# EAGLE schematic MainBoard (EAGLE 9.1.2)

## Sheet 1 of 2: LOGIC
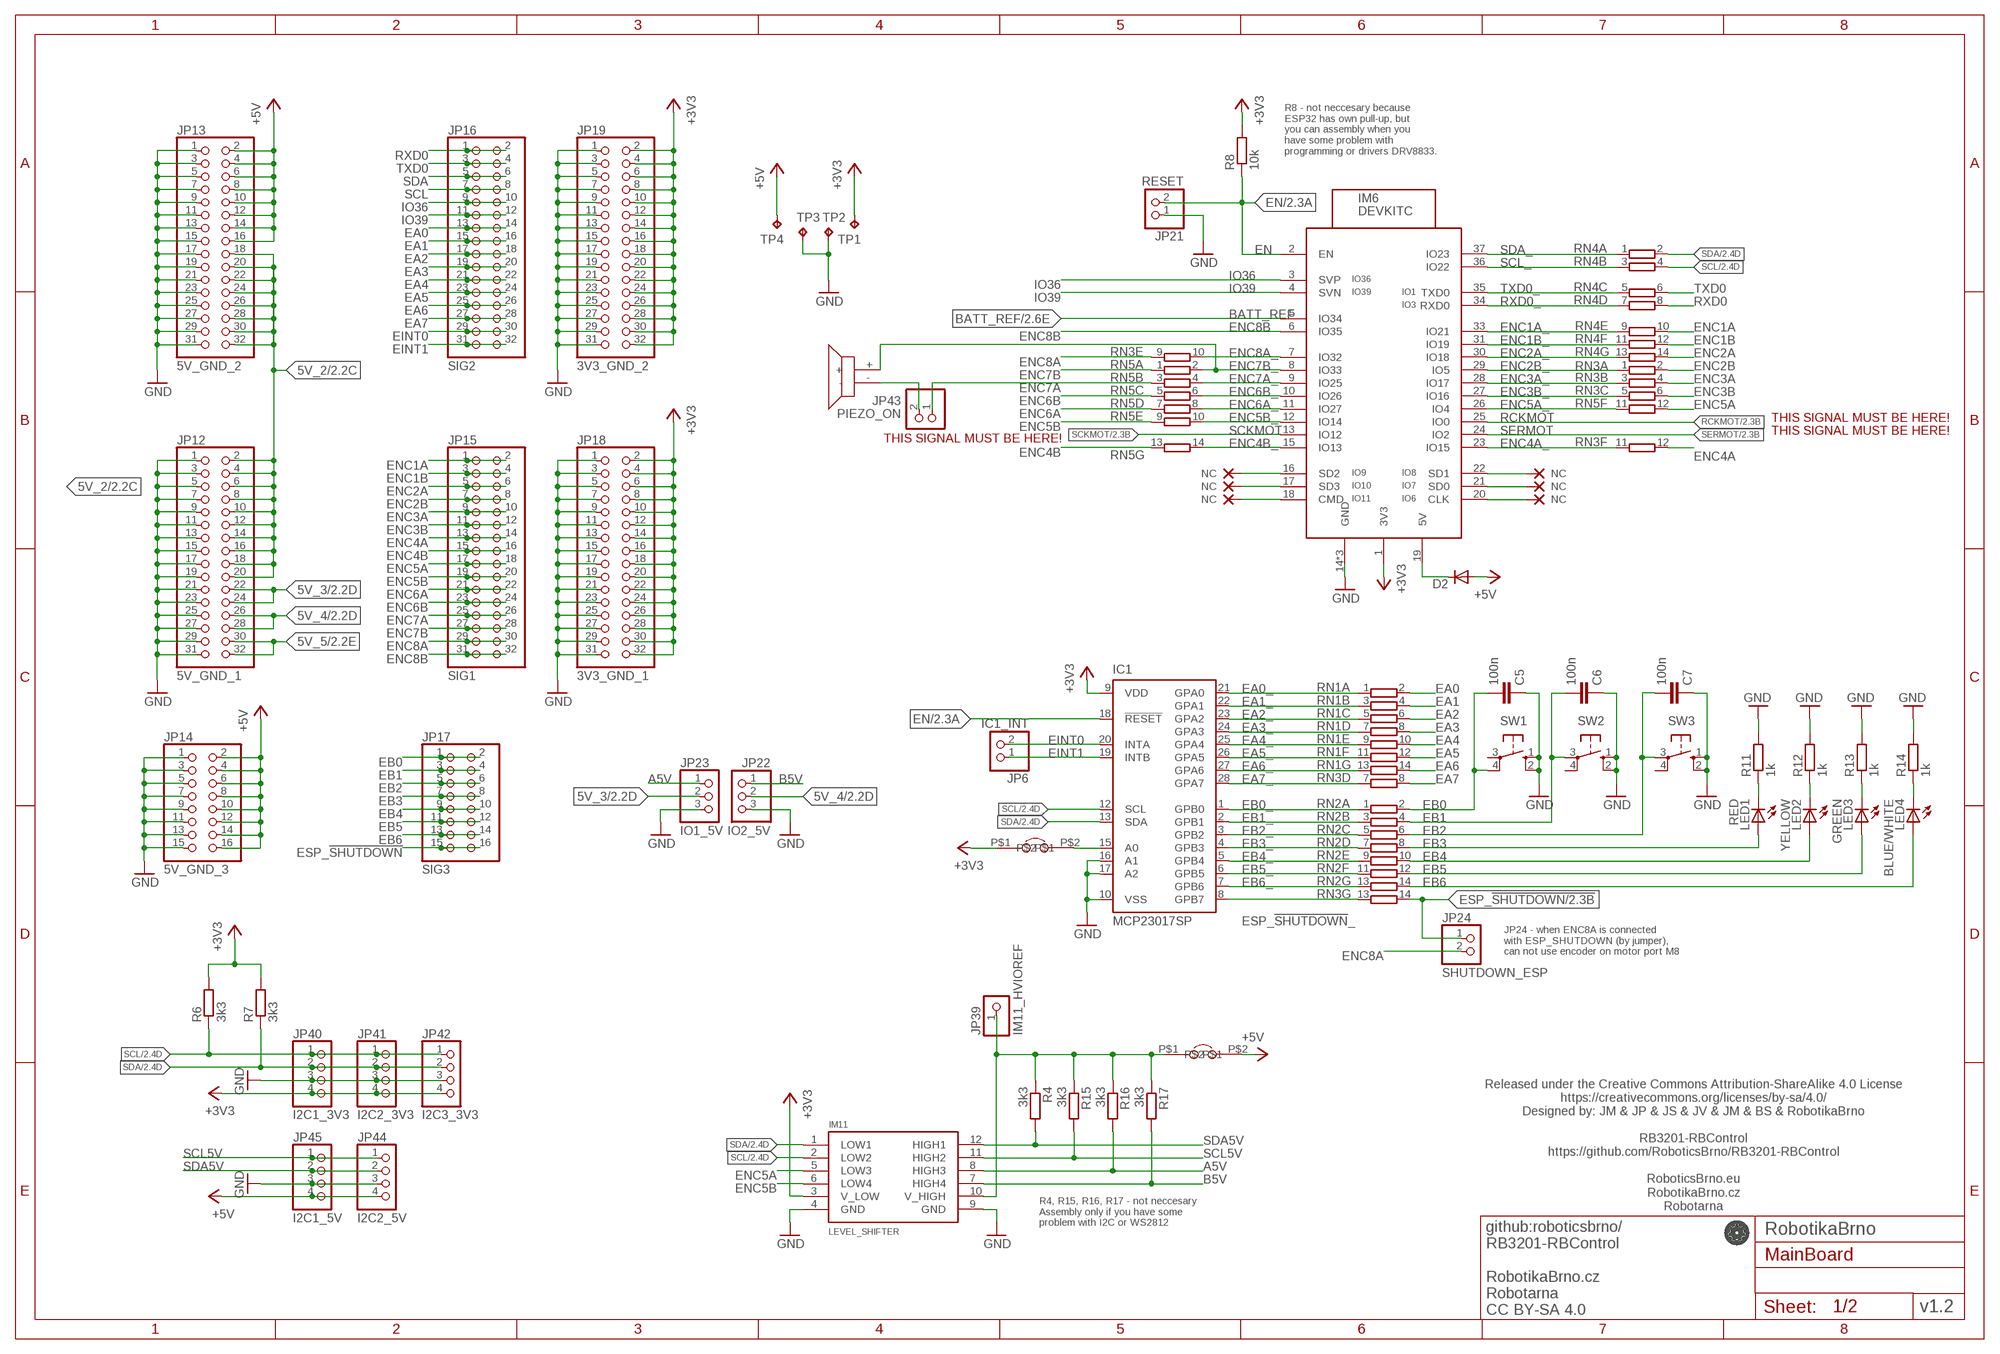
[diagram p0: schematic, sheet 1]

### Parts
C5  100n  C-EUC1206  [C1206]
C6  100n  C-EUC1206  [C1206]
C7  100n  C-EUC1206  [C1206]
D2  DIODE-D-7.5  [D-7.5]
IC1  MCP23017SP  [DIL28-3]
IM6  DEVKITC  [DEVKITC]
IM11  LEVEL_SHIFTER  [LEVEL_SHIFTER]
JP6  IC1_INT  PINHD-1X2  [1X02]
JP12  5V_GND_1  PINHD-2X16  [2X16]
JP13  5V_GND_2  PINHD-2X16  [2X16]
JP14  5V_GND_3  PINHD-2X8  [2X08]
JP15  SIG1  PINHD-2X16  [2X16]
JP16  SIG2  PINHD-2X16  [2X16]
JP17  SIG3  PINHD-2X8  [2X08]
JP18  3V3_GND_1  PINHD-2X16  [2X16]
JP19  3V3_GND_2  PINHD-2X16  [2X16]
JP21  RESET  PINHD-1X2  [1X02]
JP22  IO2_5V  PINHD-1X3  [1X03]
JP23  IO1_5V  PINHD-1X3  [1X03]
JP24  SHUTDOWN_ESP  PINHD-1X2  [1X02]
JP39  IM11_HVIOREF  PINHD-1X1  [1X01]
JP40  I2C1_3V3  PINHD-1X4  [1X04]
JP41  I2C2_3V3  PINHD-1X4  [1X04]
JP42  I2C3_3V3  PINHD-1X4  [1X04]
JP43  PIEZO_ON  PINHD-1X2/90  [1X02/90]
JP44  I2C2_5V  PINHD-1X4  [1X04]
JP45  I2C1_5V  PINHD-1X4  [1X04]
LED1  RED  LED3MM  [LED3MM]
LED2  YELLOW  LED3MM  [LED3MM]
LED3  GREEN  LED3MM  [LED3MM]
LED4  BLUE/WHITE  LED3MM  [LED3MM]
NC1  NC  (no package)
NC2  NC  (no package)
NC3  NC  (no package)
NC4  NC  (no package)
NC5  NC  (no package)
NC6  NC  (no package)
PIEZO  PIEZO  [PIEZO]
R4  3k3  R-EU_0204/2V  [0204V]
R6  3k3  R-EU_0204/2V  [0204V]
R7  3k3  R-EU_0204/2V  [0204V]
R8  10k  R-EU_0204/2V  [0204V]
R11  1k  R-EU_0204/2V  [0204V]
R12  1k  R-EU_0204/2V  [0204V]
R13  1k  R-EU_0204/2V  [0204V]
R14  1k  R-EU_0204/2V  [0204V]
R15  3k3  R-EU_0204/2V  [0204V]
R16  3k3  R-EU_0204/2V  [0204V]
R17  3k3  R-EU_0204/2V  [0204V]
RN1  E7R  [SIL14]
RN2  E7R  [SIL14]
RN3  E7R  [SIL14]
RN4  E7R  [SIL14]
RN5  E7R  [SIL14]
SW1  10-XX  [B3F-10XX]
SW2  10-XX  [B3F-10XX]
SW3  10-XX  [B3F-10XX]
TP1  TPTP20SQ  [TP20SQ]
TP2  TPTP20SQ  [TP20SQ]
TP3  TPTP20SQ  [TP20SQ]
TP4  TPTP20SQ  [TP20SQ]
U$1  SJ_NC  [SJ_NC]
U$2  SJ_NC  [SJ_NC]

### Nets
5V_2: JP12.2 JP12.4 JP12.6 JP12.8 JP12.10 JP12.12 JP12.14 JP12.16 JP12.18 JP12.20 JP13.18 JP13.20 JP13.22 JP13.24 JP13.26 JP13.28 JP13.30 JP13.32 ; also sheet 2
5V_3: JP12.22 JP12.24 JP23.2 ; also sheet 2
5V_4: JP12.26 JP12.28 JP22.2 ; also sheet 2
5V_5: JP12.30 JP12.32 ; also sheet 2
+3V3: IC1.9(VDD) IM6.1(3V3) IM11.3(V_LOW) JP18.2 JP18.4 JP18.6 JP18.8 JP18.10 JP18.12 JP18.14 JP18.16 JP18.18 JP18.20 JP18.22 JP18.24 JP18.26 JP18.28 JP18.30 JP18.32 JP19.2 JP19.4 JP19.6 JP19.8 JP19.10 JP19.12 JP19.14 JP19.16 JP19.18 JP19.20 JP19.22 JP19.24 JP19.26 JP19.28 JP19.30 JP19.32 JP40.4 JP41.4 JP42.4 R6.2 R7.2 R8.2 TP1.TP U$1.P$1 ; also sheet 2
+5V: D2.A JP13.2 JP13.4 JP13.6 JP13.8 JP13.10 JP13.12 JP13.14 JP13.16 JP14.2 JP14.4 JP14.6 JP14.8 JP14.10 JP14.12 JP14.14 JP14.16 JP44.4 JP45.4 TP4.TP U$2.P$2 ; also sheet 2
+5V_ESP: D2.C IM6.19(5V)
A5V: IM11.8(HIGH3) JP23.1 R16.2
B5V: IM11.7(HIGH4) JP22.1 R17.2
BATT_REF: IM6.5(IO34) ; also sheet 2
EA0: JP16.13 JP16.14 RN1.2
EA0_: IC1.21(GPA0) RN1.1
EA1: JP16.15 JP16.16 RN1.4
EA1_: IC1.22(GPA1) RN1.3
EA2: JP16.17 JP16.18 RN1.6
EA2_: IC1.23(GPA2) RN1.5
EA3: JP16.19 JP16.20 RN1.8
EA3_: IC1.24(GPA3) RN1.7
EA4: JP16.21 JP16.22 RN1.10
EA4_: IC1.25(GPA4) RN1.9
EA5: JP16.23 JP16.24 RN1.12
EA5_: IC1.26(GPA5) RN1.11
EA6: JP16.25 JP16.26 RN1.14
EA6_: IC1.27(GPA6) RN1.13
EA7: JP16.27 JP16.28 RN3.8
EA7_: IC1.28(GPA7) RN3.7
EB0: C5.2 JP17.1 JP17.2 RN2.2 SW1.4(P1)
EB0_: IC1.1(GPB0) RN2.1
EB1: C6.2 JP17.3 JP17.4 RN2.4 SW2.3(P)
EB1_: IC1.2(GPB1) RN2.3
EB2: C7.2 JP17.5 JP17.6 RN2.6 SW3.3(P)
EB2_: IC1.3(GPB2) RN2.5
EB3: JP17.7 JP17.8 LED1.A RN2.8
EB3_: IC1.4(GPB3) RN2.7
EB4: JP17.9 JP17.10 LED2.A RN2.10
EB4_: IC1.5(GPB4) RN2.9
EB5: JP17.11 JP17.12 LED3.A RN2.12
EB5_: IC1.6(GPB5) RN2.11
EB6: JP17.13 JP17.14 LED4.A RN2.14
EB6_: IC1.7(GPB6) RN2.13
EINT0: IC1.20(INTA) JP6.2 JP16.29 JP16.30
EINT1: IC1.19(INTB) JP6.1 JP16.31 JP16.32
EN: IC1.18(!RESET) IM6.2(EN) JP21.2 R8.1 ; also sheet 2
ENC1A: JP15.1 JP15.2 RN4.10 ; also sheet 2
ENC1A_: IM6.33(IO21) RN4.9
ENC1B: JP15.3 JP15.4 RN4.12 ; also sheet 2
ENC1B_: IM6.31(IO19) RN4.11
ENC2A: JP15.5 JP15.6 RN4.14 ; also sheet 2
ENC2A_: IM6.30(IO18) RN4.13
ENC2B: JP15.7 JP15.8 RN3.2 ; also sheet 2
ENC2B_: IM6.29(IO5) RN3.1
ENC3A: JP15.9 JP15.10 RN3.4 ; also sheet 2
ENC3A_: IM6.28(IO17) RN3.3
ENC3B: JP15.11 JP15.12 RN3.6 ; also sheet 2
ENC3B_: IM6.27(IO16) RN3.5
ENC4A: JP15.13 JP15.14 RN3.12 ; also sheet 2
ENC4A_: IM6.23(IO15) RN3.11
ENC4B: JP15.15 JP15.16 RN5.13 ; also sheet 2
ENC4B_: IM6.15(IO13) RN5.14
ENC5A: IM11.5(LOW3) JP15.17 JP15.18 RN5.12 ; also sheet 2
ENC5A_: IM6.26(IO4) RN5.11
ENC5B: IM11.6(LOW4) JP15.19 JP15.20 RN5.9 ; also sheet 2
ENC5B_: IM6.12(IO14) RN5.10
ENC6A: JP15.21 JP15.22 RN5.7 ; also sheet 2
ENC6A_: IM6.11(IO27) RN5.8
ENC6B: JP15.23 JP15.24 RN5.5 ; also sheet 2
ENC6B_: IM6.10(IO26) RN5.6
ENC7A: JP15.25 JP15.26 JP43.1 RN5.3 ; also sheet 2
ENC7A_: IM6.9(IO25) RN5.4
ENC7B: JP15.27 JP15.28 RN5.1 ; also sheet 2
ENC7B_: IM6.8(IO33) PIEZO.+ RN5.2
ENC8A: JP15.29 JP15.30 JP24.2 RN3.9 ; also sheet 2
ENC8A_: IM6.7(IO32) RN3.10
ENC8B: IM6.6(IO35) JP15.31 JP15.32 ; also sheet 2
ESP_!SHUTDOWN: JP17.15 JP17.16 JP24.1 RN3.14 ; also sheet 2
ESP_!SHUTDOWN!_: IC1.8(GPB7) RN3.13
EXP_A0: IC1.15(A0) U$1.P$2
GND: C5.1 C6.1 C7.1 IC1.10(VSS) IC1.16(A1) IC1.17(A2) IM6.14(GND) IM6.32(GND) IM6.38(GND) IM11.4(GND) IM11.9(GND) JP12.1 JP12.3 JP12.5 JP12.7 JP12.9 JP12.11 JP12.13 JP12.15 JP12.17 JP12.19 JP12.21 JP12.23 JP12.25 JP12.27 JP12.29 JP12.31 JP13.1 JP13.3 JP13.5 JP13.7 JP13.9 JP13.11 JP13.13 JP13.15 JP13.17 JP13.19 JP13.21 JP13.23 JP13.25 JP13.27 JP13.29 JP13.31 JP14.1 JP14.3 JP14.5 JP14.7 JP14.9 JP14.11 JP14.13 JP14.15 JP18.1 JP18.3 JP18.5 JP18.7 JP18.9 JP18.11 JP18.13 JP18.15 JP18.17 JP18.19 JP18.21 JP18.23 JP18.25 JP18.27 JP18.29 JP18.31 JP19.1 JP19.3 JP19.5 JP19.7 JP19.9 JP19.11 JP19.13 JP19.15 JP19.17 JP19.19 JP19.21 JP19.23 JP19.25 JP19.27 JP19.29 JP19.31 JP21.1 JP22.3 JP23.3 JP40.3 JP41.3 JP42.3 JP44.3 JP45.3 R11.2 R12.2 R13.2 R14.2 SW1.1(S) SW1.2(S1) SW2.1(S) SW2.2(S1) SW3.1(S) SW3.2(S1) TP2.TP TP3.TP ; also sheet 2
HVIOREF: IM11.10(V_HIGH) JP39.1 R4.1 R15.1 R16.1 R17.1 U$2.P$1
IO6_NC: IM6.20(CLK) NC6.NC
IO7_NC: IM6.21(SD0) NC5.NC
IO8_NC: IM6.22(SD1) NC4.NC
IO9_NC: IM6.16(SD2) NC1.NC
IO10_NC: IM6.17(SD3) NC2.NC
IO11_NC: IM6.18(CMD) NC3.NC
IO36: IM6.3(SVP) JP16.9 JP16.10
IO39: IM6.4(SVN) JP16.11 JP16.12
LED1: LED1.K(C) R11.1
LED2: LED2.K(C) R12.1
LED3: LED3.K(C) R13.1
LED4: LED4.K(C) R14.1
PIEZO: JP43.2 PIEZO.-
RCKMOT: IM6.25(IO0) ; also sheet 2
RXD0: JP16.1 JP16.2 RN4.8
RXD0_: IM6.34(RXD0) RN4.7
SCKMOT: IM6.13(IO12) ; also sheet 2
SCL: IC1.12(SCL) IM11.2(LOW2) JP16.7 JP16.8 JP40.1 JP41.1 JP42.1 R6.1 RN4.4 ; also sheet 2
SCL5V: IM11.11(HIGH2) JP44.1 JP45.1 R15.2
SCL_: IM6.36(IO22) RN4.3
SDA: IC1.13(SDA) IM11.1(LOW1) JP16.5 JP16.6 JP40.2 JP41.2 JP42.2 R7.1 RN4.2 ; also sheet 2
SDA5V: IM11.12(HIGH1) JP44.2 JP45.2 R4.2
SDA_: IM6.37(IO23) RN4.1
SERMOT: IM6.24(IO2) ; also sheet 2
TXD0: JP16.3 JP16.4 RN4.6
TXD0_: IM6.35(TXD0) RN4.5
Unconnected: SW1.3(P) SW2.4(P1) SW3.4(P1)

### Notes on the sheet
- R8 - not neccesary because 
  ESP32 has own pull-up, but
  you can assembly when you
  have some problem with 
  programming or drivers DRV8833.
- THIS SIGNAL MUST BE HERE!
- THIS SIGNAL MUST BE HERE!
- THIS SIGNAL MUST BE HERE!
- JP24 - when ENC8A is connected 
  with ESP_SHUTDOWN (by jumper),
  can not use encoder on motor port M8
- Released under the Creative Commons Attribution-ShareAlike 4.0 License
  https://creativecommons.org/licenses/by-sa/4.0/
  Designed by: JM & JP & JS & JV & JM & BS & RobotikaBrno
  
  RB3201-RBControl
  https://github.com/RoboticsBrno/RB3201-RBControl
  
  RoboticsBrno.eu
  RobotikaBrno.cz
  Robotarna
- R4, R15, R16, R17 - not neccesary
  Assembly only if you have some
  problem with I2C or WS2812
- RobotikaBrno
- v1.2
- github:roboticsbrno/
  RB3201-RBControl
  
  RobotikaBrno.cz
  Robotarna
  CC BY-SA 4.0

## Sheet 2 of 2: POWER
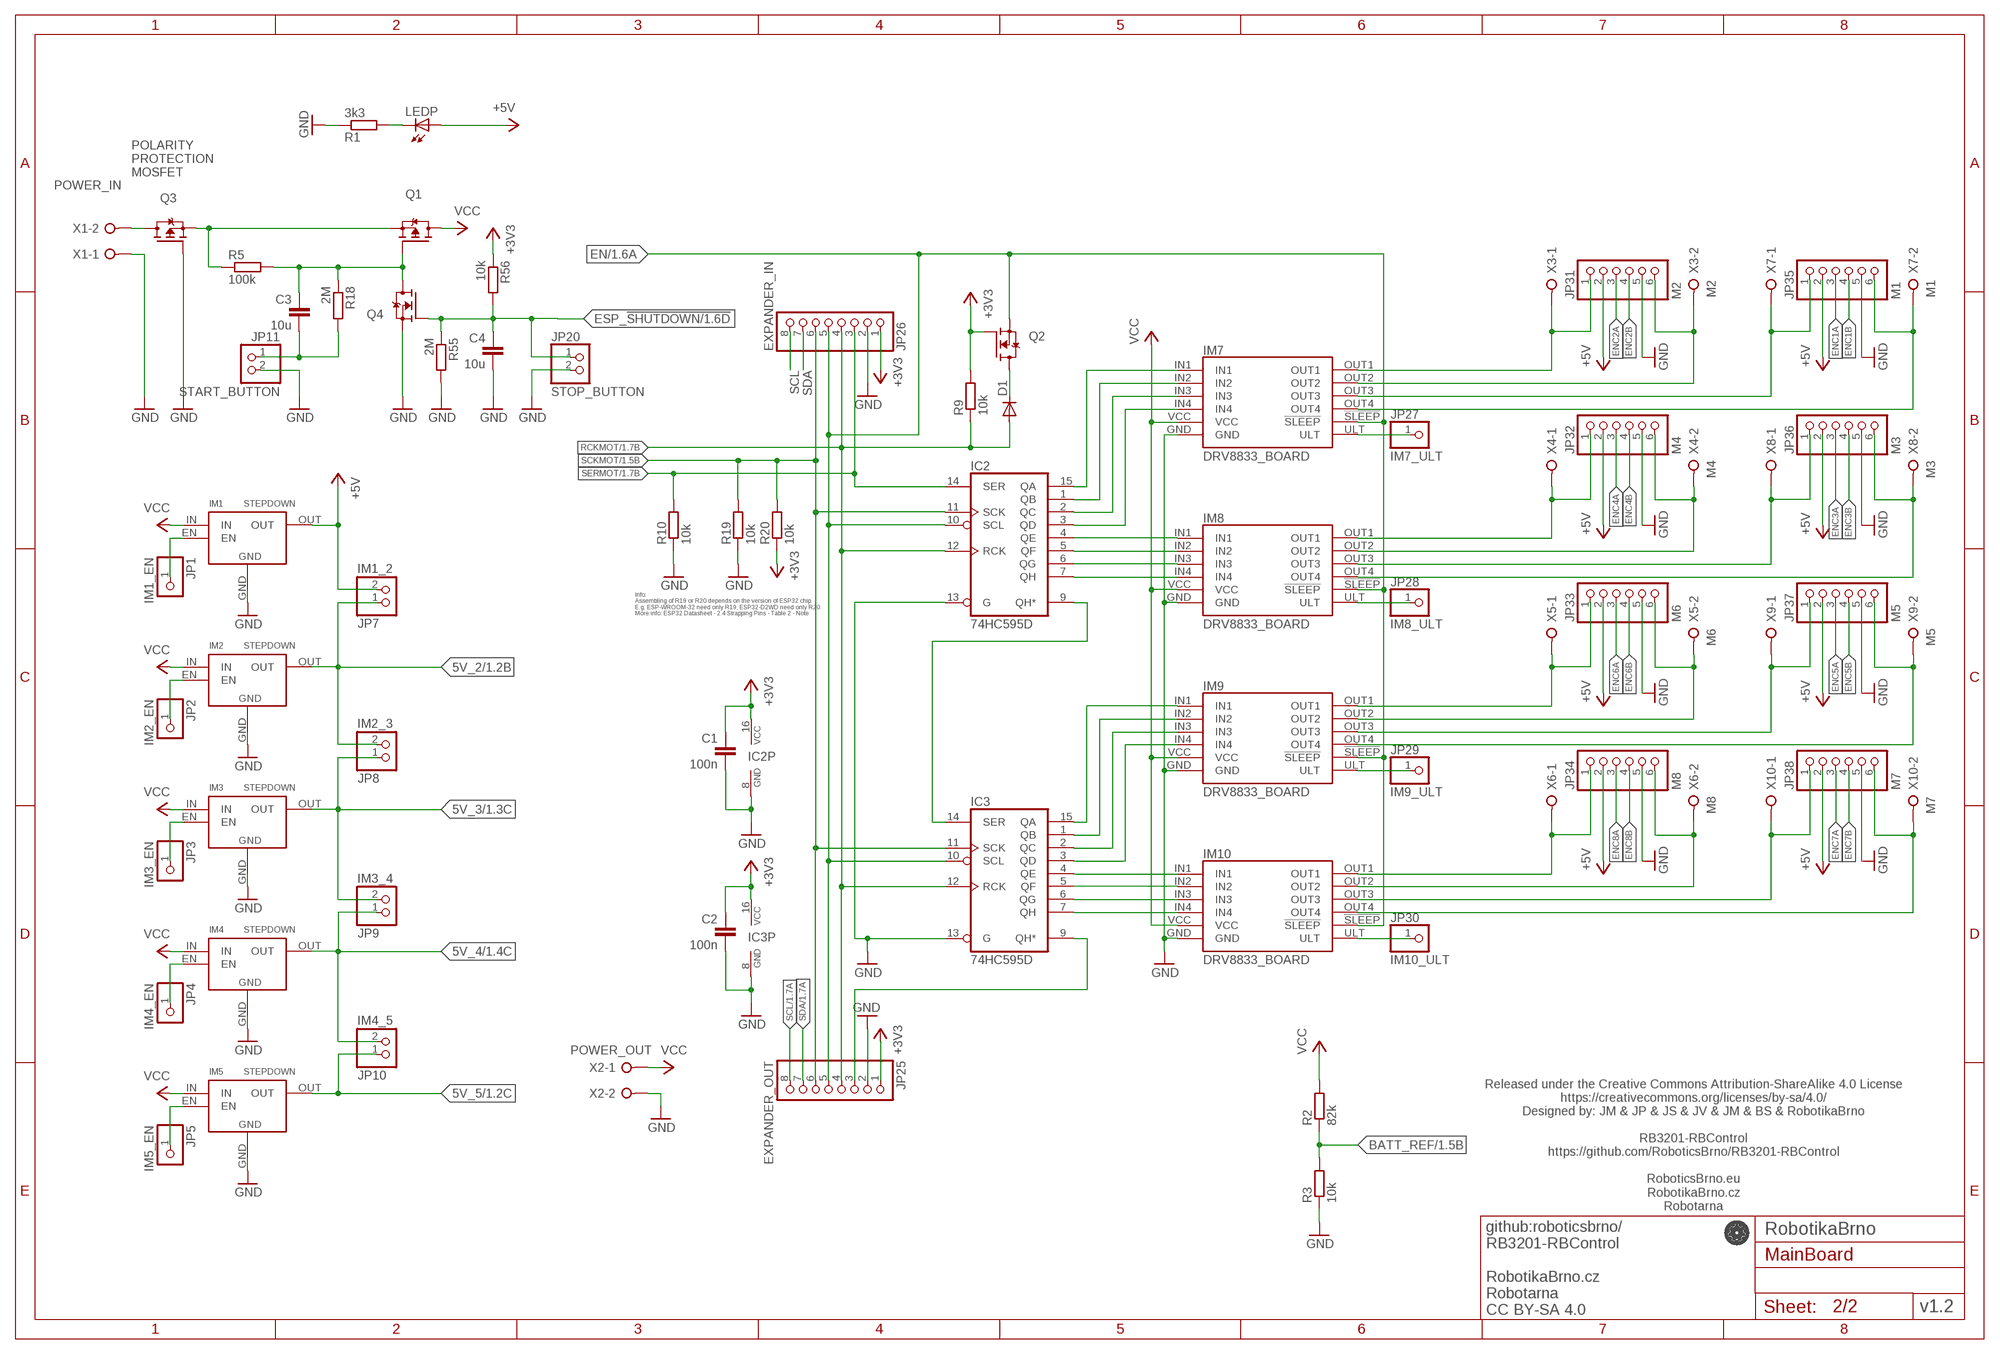
[diagram p1: schematic, sheet 2]

### Parts
C1  100n  C-EUC1206  [C1206]
C2  100n  C-EUC1206  [C1206]
C3  10u  C-EUC1206  [C1206]
C4  10u  C-EUC1206  [C1206]
D1  DIODE-D-2.5  [D-2.5]
IC2  74HC595D  [SO16]
IC3  74HC595D  [SO16]
IM1  STEPDOWN  [STEPDOWN]
IM2  STEPDOWN  [STEPDOWN]
IM3  STEPDOWN  [STEPDOWN]
IM4  STEPDOWN  [STEPDOWN]
IM5  STEPDOWN  [STEPDOWN]
IM7  DRV8833_BOARD  [PINHEAD]
IM8  DRV8833_BOARD  [PINHEAD]
IM9  DRV8833_BOARD  [PINHEAD]
IM10  DRV8833_BOARD  [PINHEAD]
JP1  IM1_EN  PINHD-1X1  [1X01]
JP2  IM2_EN  PINHD-1X1  [1X01]
JP3  IM3_EN  PINHD-1X1  [1X01]
JP4  IM4_EN  PINHD-1X1  [1X01]
JP5  IM5_EN  PINHD-1X1  [1X01]
JP7  IM1_2  PINHD-1X2  [1X02]
JP8  IM2_3  PINHD-1X2  [1X02]
JP9  IM3_4  PINHD-1X2  [1X02]
JP10  IM4_5  PINHD-1X2  [1X02]
JP11  START_BUTTON  PINHD-1X2  [1X02]
JP20  STOP_BUTTON  PINHD-1X2  [1X02]
JP25  EXPANDER_OUT  PINHD-1X8  [1X08]
JP26  EXPANDER_IN  PINHD-1X8  [1X08]
JP27  IM7_ULT  PINHD-1X1  [1X01]
JP28  IM8_ULT  PINHD-1X1  [1X01]
JP29  IM9_ULT  PINHD-1X1  [1X01]
JP30  IM10_ULT  PINHD-1X1  [1X01]
JP31  M2  PINHD-1X6  [1X06]
JP32  M4  PINHD-1X6  [1X06]
JP33  M6  PINHD-1X6  [1X06]
JP34  M8  PINHD-1X6  [1X06]
JP35  M1  PINHD-1X6  [1X06]
JP36  M3  PINHD-1X6  [1X06]
JP37  M5  PINHD-1X6  [1X06]
JP38  M7  PINHD-1X6  [1X06]
LEDP  LED3MM  [LED3MM]
Q1  P-MOSFET-TO220V  [TO220V]
Q2  N-MOSFET-TO92  [TO92]
Q3  P-MOSFET-TO220V  [TO220V]
Q4  N-MOSFET-TO92  [TO92]
R1  3k3  R-EU_0204/2V  [0204V]
R2  82k  R-EU_0204/2V  [0204V]
R3  10k  R-EU_0204/2V  [0204V]
R5  100k  R-EU_0204/2V  [0204V]
R9  10k  R-EU_0204/2V  [0204V]
R10  10k  R-EU_0204/2V  [0204V]
R18  2M  R-EU_0204/2V  [0204V]
R19  10k  R-EU_0204/2V  [0204V]
R20  10k  R-EU_0204/2V  [0204V]
R55  2M  R-EU_0204/2V  [0204V]
R56  10k  R-EU_0204/2V  [0204V]
X1  POWER_IN  W237-02P  [W237-132]
X2  POWER_OUT  W237-02P  [W237-132]
X3  M2  W237-02P  [W237-132]
X4  M4  W237-02P  [W237-132]
X5  M6  W237-02P  [W237-132]
X6  M8  W237-02P  [W237-132]
X7  M1  W237-02P  [W237-132]
X8  M3  W237-02P  [W237-132]
X9  M5  W237-02P  [W237-132]
X10  M7  W237-02P  [W237-132]

### Nets
5V_2: IM2.OUT JP7.1 JP8.2 ; also sheet 1
5V_3: IM3.OUT JP8.1 JP9.2 ; also sheet 1
5V_4: IM4.OUT JP9.1 JP10.2 ; also sheet 1
5V_5: IM5.OUT JP10.1 ; also sheet 1
!FAULT0: IM7.ULT JP27.1
!FAULT1: IM8.ULT JP28.1
!FAULT2: IM9.ULT JP29.1
!FAULT3: IM10.ULT JP30.1
+3V3: C1.1 C2.1 IC2.16(VCC) IC3.16(VCC) JP25.1 JP26.1 Q2.2(G) R9.2 R20.1 R56.1 ; also sheet 1
+5V: IM1.OUT JP7.2 JP31.2 JP32.2 JP33.2 JP34.2 JP35.2 JP36.2 JP37.2 JP38.2 LEDP.A ; also sheet 1
_EN_: D1.C Q2.1(D)
BAT: Q3.2(D) X1.2
BAT_PROT: Q1.3(S) Q3.3(S) R5.1
BATT_REF: R2.1 R3.2 ; also sheet 1
EN: IC2.10(SCL) IC3.10(SCL) IM7.!SLEEP IM8.!SLEEP IM9.!SLEEP IM10.!SLEEP JP25.5 JP26.5 Q2.3(S) ; also sheet 1
ENC1A: JP35.3 ; also sheet 1
ENC1B: JP35.4 ; also sheet 1
ENC2A: JP31.3 ; also sheet 1
ENC2B: JP31.4 ; also sheet 1
ENC3A: JP36.3 ; also sheet 1
ENC3B: JP36.4 ; also sheet 1
ENC4A: JP32.3 ; also sheet 1
ENC4B: JP32.4 ; also sheet 1
ENC5A: JP37.3 ; also sheet 1
ENC5B: JP37.4 ; also sheet 1
ENC6A: JP33.3 ; also sheet 1
ENC6B: JP33.4 ; also sheet 1
ENC7A: JP38.3 ; also sheet 1
ENC7B: JP38.4 ; also sheet 1
ENC8A: JP34.3 ; also sheet 1
ENC8B: JP34.4 ; also sheet 1
ESP_!SHUTDOWN: C4.1 JP20.1 Q4.2(G) R55.1 R56.2 ; also sheet 1
GND: C1.2 C2.2 C4.2 IC2.8(GND) IC2.13(G) IC3.8(GND) IC3.13(G) IM1.GND IM2.GND IM3.GND IM4.GND IM5.GND IM7.GND IM8.GND IM9.GND IM10.GND JP11.2 JP20.2 JP25.2 JP26.2 JP31.5 JP32.5 JP33.5 JP34.5 JP35.5 JP36.5 JP37.5 JP38.5 Q3.1(G) Q4.3(S) R1.1 R3.1 R10.1 R19.1 R55.2 X1.1 X2.2 ; also sheet 1
IC2_A: IC2.15(QA) IM7.IN1
IC2_B: IC2.1(QB) IM7.IN2
IC2_C: IC2.2(QC) IM7.IN3
IC2_D: IC2.3(QD) IM7.IN4
IC2_E: IC2.4(QE) IM8.IN1
IC2_F: IC2.5(QF) IM8.IN2
IC2_G: IC2.6(QG) IM8.IN3
IC2_H: IC2.7(QH) IM8.IN4
IC2_QH*: IC2.9(QH*) IC3.14(SER)
IC3_A: IC3.15(QA) IM9.IN1
IC3_B: IC3.1(QB) IM9.IN2
IC3_C: IC3.2(QC) IM9.IN3
IC3_D: IC3.3(QD) IM9.IN4
IC3_E: IC3.4(QE) IM10.IN1
IC3_F: IC3.5(QF) IM10.IN2
IC3_G: IC3.6(QG) IM10.IN3
IC3_H: IC3.7(QH) IM10.IN4
IC3_QH*: IC3.9(QH*) JP25.3
IM7_O1: IM7.OUT1 JP31.1 X3.1
IM7_O2: IM7.OUT2 JP31.6 X3.2
IM7_O3: IM7.OUT3 JP35.1 X7.1
IM7_O4: IM7.OUT4 JP35.6 X7.2
IM8_O1: IM8.OUT1 JP32.1 X4.1
IM8_O2: IM8.OUT2 JP32.6 X4.2
IM8_O3: IM8.OUT3 JP36.1 X8.1
IM8_O4: IM8.OUT4 JP36.6 X8.2
IM9_O1: IM9.OUT1 JP33.1 X5.1
IM9_O2: IM9.OUT2 JP33.6 X5.2
IM9_O3: IM9.OUT3 JP37.1 X9.1
IM9_O4: IM9.OUT4 JP37.6 X9.2
IM10_O1: IM10.OUT1 JP34.1 X6.1
IM10_O2: IM10.OUT2 JP34.6 X6.2
IM10_O3: IM10.OUT3 JP38.1 X10.1
IM10_O4: IM10.OUT4 JP38.6 X10.2
N$4: IM1.EN JP1.1
N$9: LEDP.K(C) R1.2
RCKMOT: D1.A IC2.12(RCK) IC3.12(RCK) JP25.4 JP26.4 R9.1 ; also sheet 1
SCKMOT: IC2.11(SCK) IC3.11(SCK) JP25.6 JP26.6 R19.2 R20.2 ; also sheet 1
SCL: JP25.8 JP26.8 ; also sheet 1
SDA: JP25.7 JP26.7 ; also sheet 1
SERMOT: IC2.14(SER) JP26.3 R10.2 ; also sheet 1
START_BUTTON: C3.2 JP11.1 R18.2
START_GATE: C3.1 Q1.1(G) Q4.1(D) R5.2 R18.1
STEP2_EN: IM2.EN JP2.1
STEP3_EN: IM3.EN JP3.1
STEP4_EN: IM4.EN JP4.1
STEP5_EN: IM5.EN JP5.1
VCC: IM1.IN IM2.IN IM3.IN IM4.IN IM5.IN IM7.VCC IM8.VCC IM9.VCC IM10.VCC Q1.2(D) R2.2 X2.1

### Notes on the sheet
- POLARITY 
  PROTECTION 
  MOSFET
- Info:
  Assembling of R19 or R20 depends on the version of ESP32 chip.
  E.g. ESP-WROOM-32 need only R19, ESP32-D2WD need only R20.
  More info: ESP32 Datasheet - 2.4 Strapping Pins - Table 2 - Note
- Released under the Creative Commons Attribution-ShareAlike 4.0 License
  https://creativecommons.org/licenses/by-sa/4.0/
  Designed by: JM & JP & JS & JV & JM & BS & RobotikaBrno
  
  RB3201-RBControl
  https://github.com/RoboticsBrno/RB3201-RBControl
  
  RoboticsBrno.eu
  RobotikaBrno.cz
  Robotarna
- RobotikaBrno
- v1.2
- github:roboticsbrno/
  RB3201-RBControl
  
  RobotikaBrno.cz
  Robotarna
  CC BY-SA 4.0

## Library data of the parts
C1-C7 = rcl_upravena:C-EU: CAPACITOR, European symbol
D1 D2 = diode:DIODE-: DIODE
IC1 = microchip:MCP23017: http://ww1.microchip.com/downloads/en/DeviceDoc/21952a.pdf Source: http://ww1.microchip.com/downloads/en/DeviceDoc/21952a.pdf; MF: MICROCHIP; MPN: MCP23017-E/SP; OC_FARNELL: 1332088; OC_NEWARK: 31K2959
IC2 IC3 = 74xx-eu:74*595: 8-bit SHIFT REGISTER, output latch
IM1-IM5 = StepDown:STEPDOWN
IM6 = esp32:DEVKITC
IM7-IM10 = DRV8833board:DRV8833_BOARD
IM11 = LevelShifter:LEVEL_SHIFTER
JP1-JP5 JP27-JP30 JP39 = pinhead:PINHD-1X1: PIN HEADER
JP6-JP11 JP20 JP21 JP24 JP43 = pinhead:PINHD-1X2: PIN HEADER
JP12 JP13 JP15 JP16 JP18 JP19 = pinhead:PINHD-2X16: PIN HEADER
JP14 JP17 = pinhead:PINHD-2X8: PIN HEADER
JP22 JP23 = pinhead:PINHD-1X3: PIN HEADER
JP25 JP26 = pinhead:PINHD-1X8: PIN HEADER
JP31-JP38 = pinhead:PINHD-1X6: PIN HEADER
JP40-JP42 JP44 JP45 = pinhead:PINHD-1X4: PIN HEADER
LED1-LED4 LEDP = led:LED: LED OSRAM: - CHIPLED LG R971, LG N971, LY N971, LG Q971, LY Q971, LO R971, LY R971 LH N974, LH R974 LS Q976, LO Q976, LY Q976 LO Q996 - Hyper CHIPLED LW Q18S LB Q993, LB Q99A, LB R99A - SideLED LS A670, LO A670, LY A670, LG A670, LP A670 LB A673, LV A673, LT A673, LW A673 LH A674 LY A675 LS A676, LA A676, LO A676, LY A676, LW A676 LS A679, LY A679, LG A679 - Hyper Micro SIDELED® LS Y876, LA Y876, LO Y876, LY Y876 LT Y87S - SmartLED LW L88C, LW L88S LB L89C, LB L89S, LG L890 LS L89K, LO L89K, LY L89K LS L896, LA L896, LO L896, LY L896 - TOPLED LS T670, LO T670, LY T670, LG T670, LP T670 LSG T670, LSP T670, LSY T670, LOP T670, LYG T670 LG T671, LOG T671, LSG T671 LB T673, LV T673, LT T673, LW T673 LH T674 LS T676, LA T676, LO T676, LY T676, LB T676, LH T676, LSB T676, LW T676 LB T67C, LV T67C, LT T67C, LS T67K, LO T67K, LY T67K, LW E67C LS E67B, LA E67B, LO E67B, LY E67B, LB E67C, LV E67C, LT E67C LW T67C LS T679, LY T679, LG T679 LS T770, LO T770, LY T770, LG T770, LP T770 LB T773, LV T773, LT T773, LW T773 LH T774 LS E675, LA E675, LY E675, LS T675 LS T776, LA T776, LO T776, LY T776, LB T776 LHGB T686 LT T68C, LB T68C - Hyper Mini TOPLED® LB M676 - Mini TOPLED Santana® LG M470 LS M47K, LO M47K, LY M47K Source: http://www.osram.convergy.de LUXEON: - LUMILED® LXK2-PW12-R00, LXK2-PW12-S00, LXK2-PW14-U00, LXK2-PW14-V00 LXK2-PM12-R00, LXK2-PM12-S00, LXK2-PM14-U00 LXK2-PE12-Q00, LXK2-PE12-R00, LXK2-PE12-S00, LXK2-PE14-T00, LXK2-PE14-U00 LXK2-PB12-K00, LXK2-PB12-L00, LXK2-PB12-M00, LXK2-PB14-N00, LXK2-PB14-P00, LXK2-PB14-Q00 LXK2-PR12-L00, LXK2-PR12-M00, LXK2-PR14-Q00, LXK2-PR14-R00 LXK2-PD12-Q00, LXK2-PD12-R00, LXK2-PD12-S00 LXK2-PH12-R00, LXK2-PH12-S00 LXK2-PL12-P00, LXK2-PL12-Q00, LXK2-PL12-R00 Source: www.luxeon.com KINGBRIGHT: KA-3528ASYC Source: www.kingbright.com
NC1-NC6 = NC:NC: _EXTERNAL_
PIEZO = piezo:PIEZO
Q1 Q3 = transistors:P-MOSFET
Q2 Q4 = transistors:N-MOSFET
R1-R4 R6 R7 R11-R17 = resistor:R-EU_: RESISTOR, European symbol
R5 R8-R10 R18-R20 R55 R56 = rcl_upravena:R-EU_: RESISTOR, European symbol
RN1-RN5 = resistor-sil:E7R: SIL RESISTOR; OC_FARNELL: unknown; OC_MOUSER: 652-4614X-2LF-180; OC_NEWARK: unknown
SW1-SW3 = switch-omron:10-XX: OMRON SWITCH; MPN: B3F-1000; OC_FARNELL: 176432; OC_NEWARK: 36M3542
TP1-TP4 = testpad:TP: Test pad
U$1 U$2 = SolderJumperNormallyClosed:SJ_NC
X1-X10 = con-wago-508:W237-02P: WAGO SREW CLAMP; OC_FARNELL: unknown; OC_NEWARK: unknown

## Net classes
0 default: width 0.2 mm, drill 0.35 mm, clearance 0.2 mm